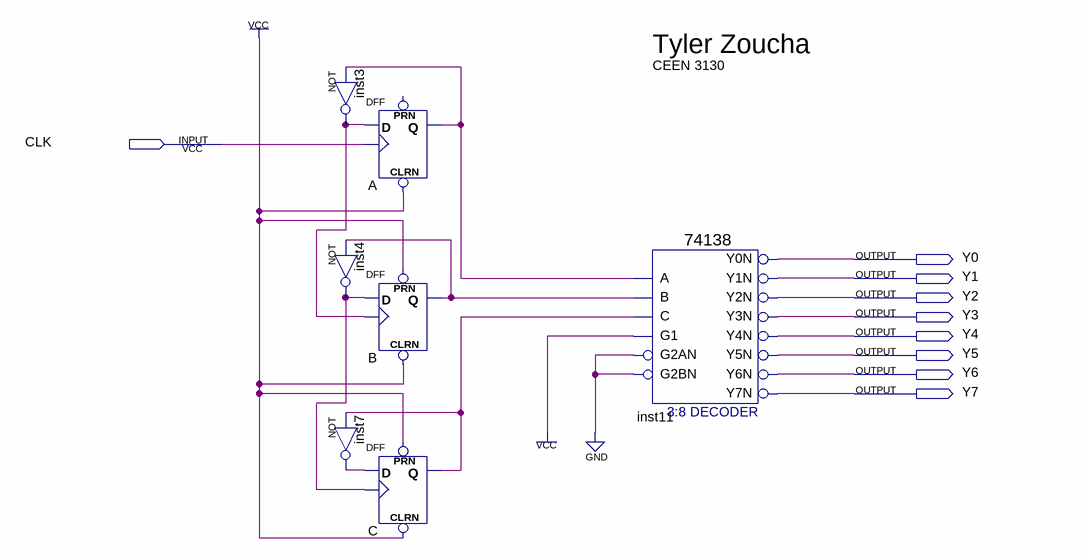
[diagram p0: schematic sheet]
// Quartus schematic RippleCounter.bdf as structural Verilog: 7 symbols, 9 pins
module RippleCounter (
  input  CLK,
  output Y0,
  output Y1,
  output Y2,
  output Y3,
  output Y4,
  output Y5,
  output Y6,
  output Y7
);

  wire A_q, B_q, C_q, inst3_out, inst4_out, inst7_out;

  not inst3 (inst3_out, A_q);
  not inst4 (inst4_out, B_q);
  not inst7 (inst7_out, C_q);
  DFF A (.CLRN(1'b1), .CLK(CLK), .D(inst3_out), .Q(A_q));  // open: PRN
  DFF B (.CLRN(1'b1), .CLK(inst3_out), .D(inst4_out), .PRN(1'b1), .Q(B_q));
  DFF C (.CLRN(1'b1), .CLK(inst4_out), .D(inst7_out), .PRN(1'b1), .Q(C_q));
  \74138  inst11 (
    .A(A_q), .B(B_q), .G1(1'b1), .C(C_q), .G2AN(1'b0), .G2BN(1'b0), .Y0N(Y0), .Y1N(Y1), .Y2N(Y2), .Y3N(Y3),
    .Y4N(Y4), .Y5N(Y5), .Y6N(Y6), .Y7N(Y7));

  // Notes on the sheet:
  //   Tyler Zoucha
  //   CEEN 3130
endmodule
